# Altium project tnb_mns_power.PrjPcb
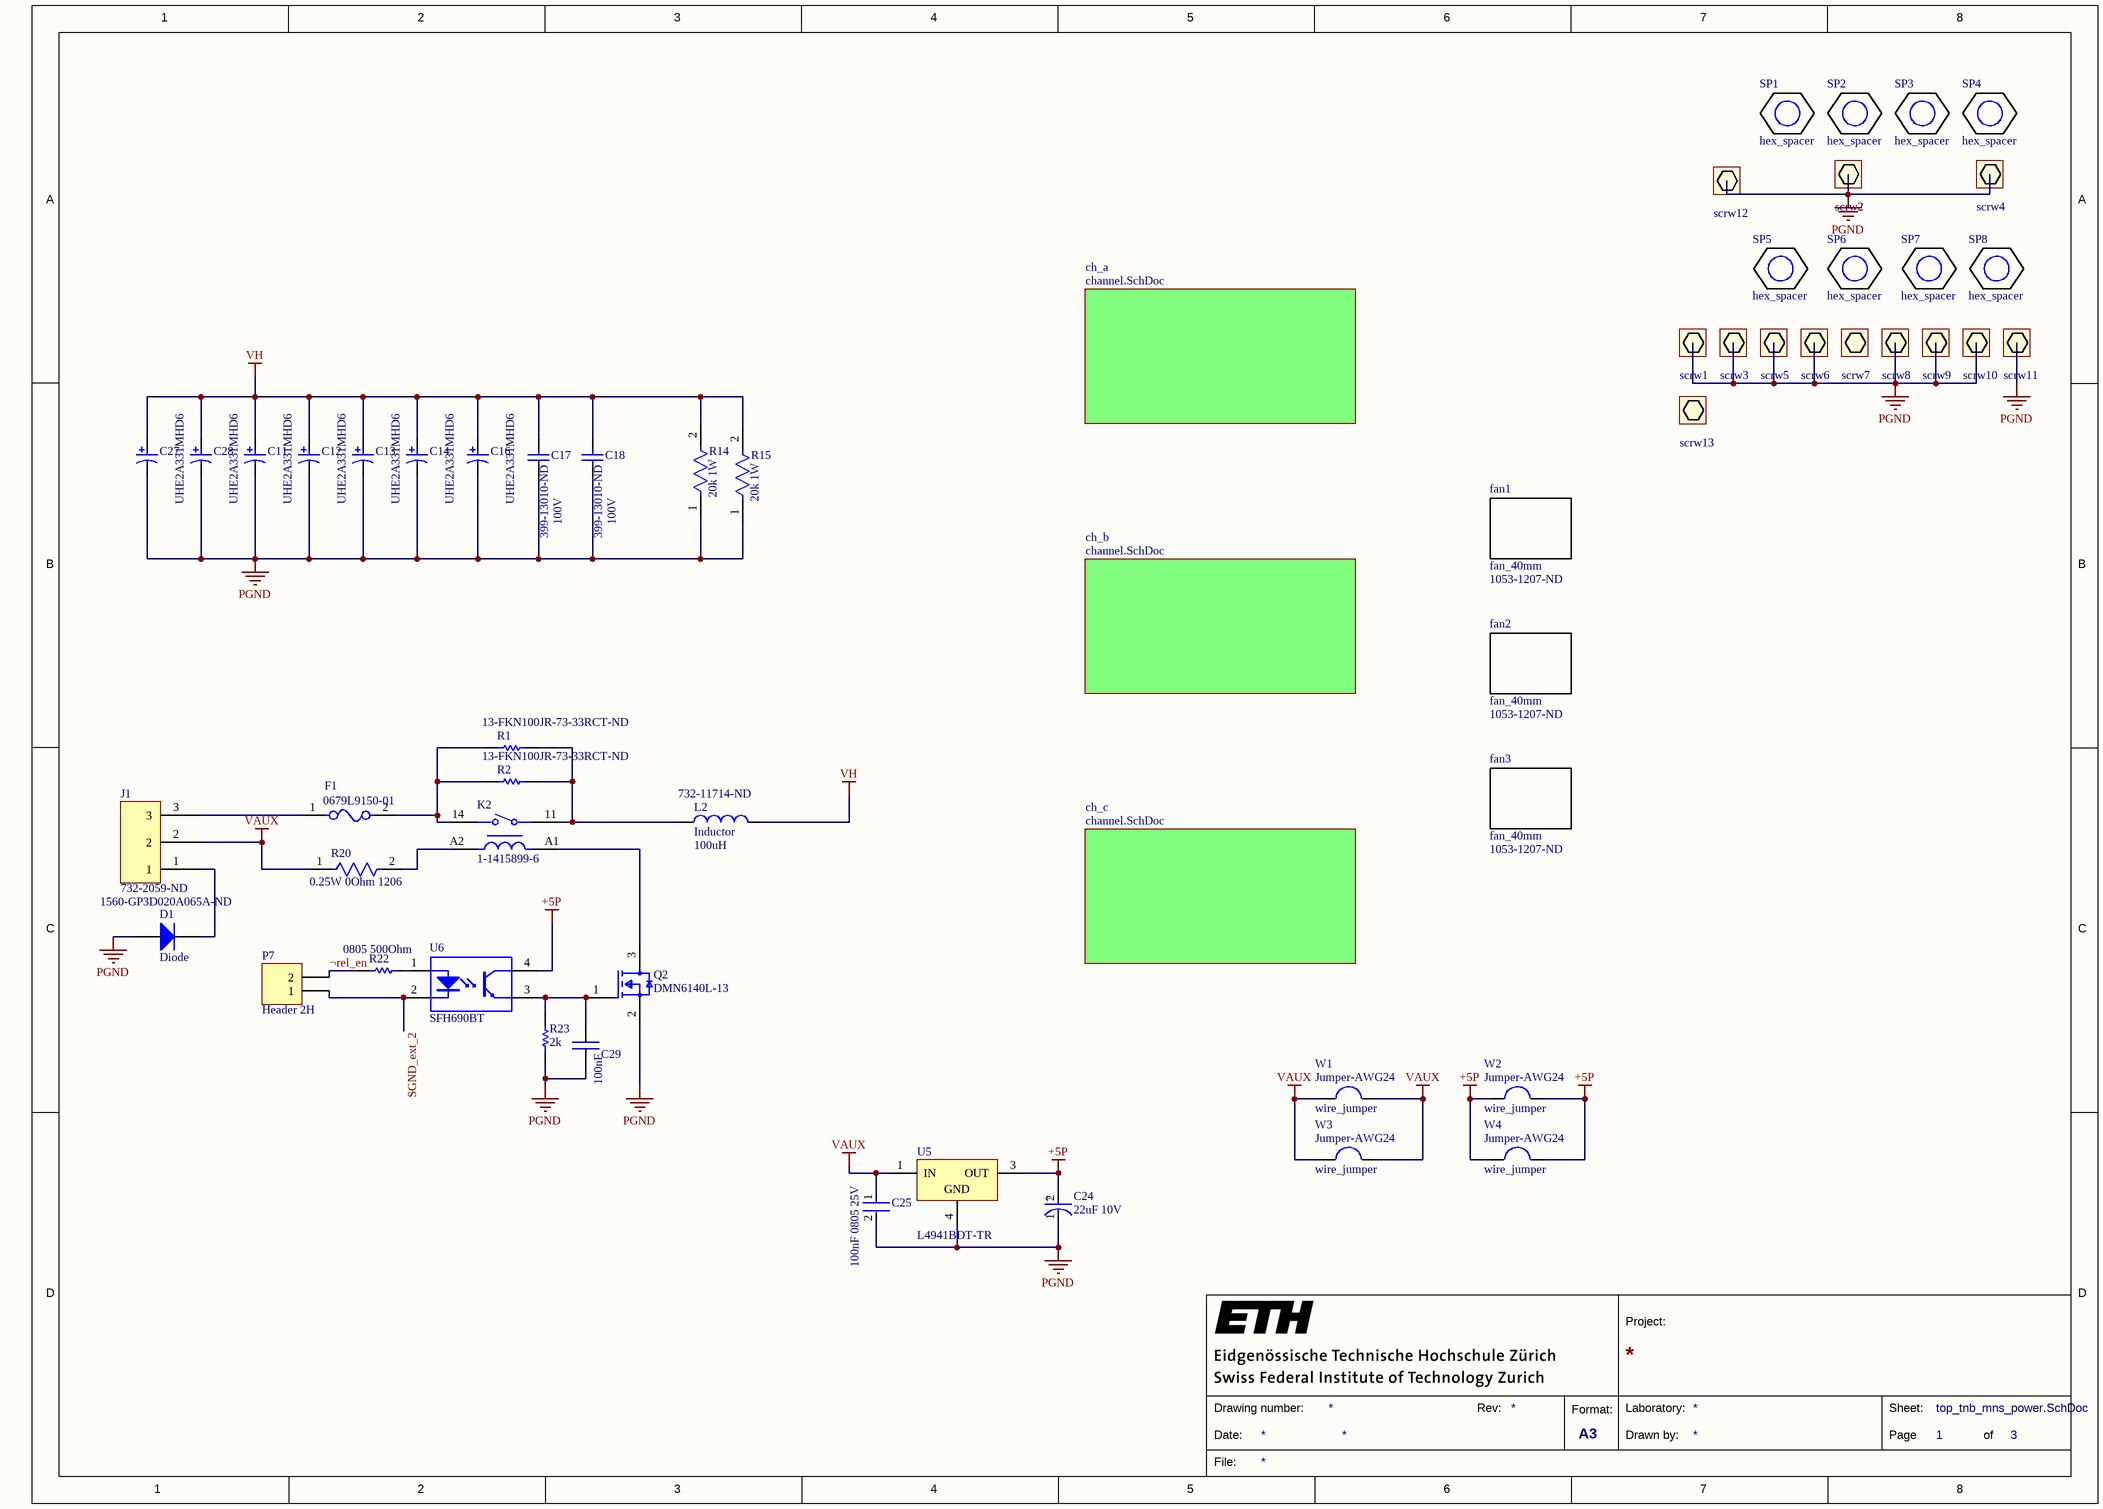
[diagram p0: top_tnb_mns_power.SchDoc]
3 sheets, 344 parts. Net scope: flat (ports and power ports of the same name join across sheets).
Board file: tnb_mns_power.PcbDoc
Sheets:
  top_tnb_mns_power.SchDoc
    ch_a = channel.SchDoc
      drvr_bck = 2EDL23.SchDoc
      aleg = 2EDL23.SchDoc
      bleg = 2EDL23.SchDoc
    ch_b = channel.SchDoc
      drvr_bck = 2EDL23.SchDoc
      aleg = 2EDL23.SchDoc
      bleg = 2EDL23.SchDoc
    ch_c = channel.SchDoc
      drvr_bck = 2EDL23.SchDoc
      aleg = 2EDL23.SchDoc
      bleg = 2EDL23.SchDoc

## Sheet top_tnb_mns_power.SchDoc
size A3; SheetNumber: 1; SheetTotal: 3

### Parts
C11  UHE2A331MHD6  [CAPPR80-750-2000X1800X2200]
C12  UHE2A331MHD6  [CAPPR80-750-2000X1800X2200]
C13  UHE2A331MHD6  [CAPPR80-750-2000X1800X2200]
C14  UHE2A331MHD6  [CAPPR80-750-2000X1800X2200]
C16  UHE2A331MHD6  [CAPPR80-750-2000X1800X2200]
C17  100V  Supplier Part Number 1: 399-13010-ND  [FILM_CAP_100UF_100V_R60EW61005000K]
C18  100V  Supplier Part Number 1: 399-13010-ND  [FILM_CAP_100UF_100V_R60EW61005000K]
C24  22uF 10V  [FP-T491C226K010AT-MFG]
C25  100nF 0805 25V  [FP-CC0805-0_85-MFG]
C27  UHE2A331MHD6  [CAPPR80-750-2000X1800X2200]
C28  UHE2A331MHD6  [CAPPR80-750-2000X1800X2200]
C29  100nF  [CAP 0603_1608]
D1  Diode  Supplier Part Number 1: 1560-GP3D020A065A-ND  [TO-220-2-bent]
F1  0679L9150-01  [FP-0679L-MFG]
fan1  fan_40mm  Supplier Part Number 1: 1053-1207-ND
fan2  fan_40mm  Supplier Part Number 1: 1053-1207-ND
fan3  fan_40mm  Supplier Part Number 1: 1053-1207-ND
J1  Supplier Part Number 1: 732-2059-ND  [691311500103]  (hidden comment: 20A straight)
K2  1-1415899-6  [FP-1-1415899-6-MFG]
L2  Inductor  value 100uH  Supplier Part Number 1: 732-11714-ND  [wurth_inductor_74437529203101_100uH]
P7  Header 2H  [header_2_1_m]
Q2  DMN6140L-13  [FP-SOT23-MFG]
R1  Supplier Part Number 1: 13-FKN100JR-73-33RCT-ND  [safety_resistor_30Ohm_1W]  (hidden comment: 30Ohm Fusable Resistor)
R2  Supplier Part Number 1: 13-FKN100JR-73-33RCT-ND  [safety_resistor_30Ohm_1W]  (hidden comment: 30Ohm Fusable Resistor)
R14  20k 1W  [FP-CRCW2512-e3-IPC_C]
R15  20k 1W  [FP-CRCW2512-e3-IPC_C]
R20  0.25W 0Ohm 1206  [FP-CRCW1206-e3-MFG]
R22  0805 500Ohm  [RES 0805_2012]
R23  2k  [RES 0805_2012]
scrw1  screw_m2_5  [screw_m2_5]  (value not drawn)
scrw2  screw_m2_5  [screw_m2_5]  (value not drawn)
scrw3  screw_m2_5  [screw_m2_5]  (value not drawn)
scrw4  screw_m2_5  [screw_m2_5]  (value not drawn)
scrw5  screw_m2_5  [screw_m2_5]  (value not drawn)
scrw6  screw_m2_5  [screw_m2_5]  (value not drawn)
scrw7  screw_m2_5  [screw_m2_5]  (value not drawn)
scrw8  screw_m2_5  [screw_m2_5]  (value not drawn)
scrw9  screw_m2_5  [screw_m2_5]  (value not drawn)
scrw10  screw_m2_5  [screw_m2_5]  (value not drawn)
scrw11  screw_m2_5  [screw_m2_5]  (value not drawn)
scrw12  screw_m2_5  [screw_m2_5]  (value not drawn)
scrw13  screw_m2_5  [screw_m2_5]  (value not drawn)
SP1  hex_spacer  [HEX_SPACER _8MM_60MM]
SP2  hex_spacer  [HEX_SPACER _8MM_60MM]
SP3  hex_spacer  [HEX_SPACER _8MM_60MM]
SP4  hex_spacer  [HEX_SPACER _8MM_60MM]
SP5  hex_spacer  [HEX_SPACER _8MM_60MM]
SP6  hex_spacer  [HEX_SPACER _8MM_60MM]
SP7  hex_spacer  [HEX_SPACER _8MM_60MM]
SP8  hex_spacer  [HEX_SPACER _8MM_60MM]
U5  L4941BDT-TR  [TO-252_L]
U6  SFH690BT  [VISH-SOP-4_A_V]
W1  wire_jumper  [wire_jumper]
W2  wire_jumper  [wire_jumper]
W3  wire_jumper  [wire_jumper]
W4  wire_jumper  [wire_jumper]

### Sub-sheets
ch_a = channel.SchDoc: no entries
ch_b = channel.SchDoc: no entries
ch_c = channel.SchDoc: no entries

### Nets
+5P: C24.2(A) U5.3(OUT) U6.4(COLLECTOR) W2.1 W2.2 W4.1 W4.2
PGND: C11.2 C12.2 C13.2 C14.2 C16.2 C17.1 C18.1 C24.1(C) C25.2 C27.2 C28.2 C29.2 D1.1(A) Q2.2(S) R14.1 R15.1 R23.1 scrw1.1 scrw2.1 scrw3.1 scrw4.1 scrw5.1 scrw6.1 scrw8.1 scrw9.1 scrw10.1 scrw11.1 scrw12.1 U5.4(GND)
VAUX: C25.1 J1.2 R20.1 U5.1(IN) W1.1 W1.2 W3.1 W3.2
VH: C11.1 C12.1 C13.1 C14.1 C16.1 C17.2 C18.2 C27.1 C28.1 L2.2 R14.2 R15.2
SGND_ext_2: P7.1 U6.2(CATHODE)
¬rel_en: P7.2 R22.1
NetC29_1: C29.1 Q2.1(G) R23.2 U6.3(EMITTER)
NetD1_2: D1.2(K) J1.1
NetF1_1: F1.1 J1.3
NetF1_2: F1.2 K2.14 R1.1 R2.1
NetK2_11: K2.11 L2.1 R1.2 R2.2
NetK2_A1: K2.A1 Q2.3(D)
NetK2_A2: K2.A2 R20.2
NetR22_2: R22.2 U6.1(ANODE)

Not connected (* = marked no-connect by the designer): scrw7 1; scrw13 1

### Notes on the sheet
- 1
- 2
- 3
- 4
- 5
- 6
- 7
- 8
- A
- B
- C
- D
- Project:
- Date:
- Drawing number:
- Rev:
- Format:
- A3
- Drawn by:
- Laboratory:
- Page
- Sheet:
- of
- File:
- (in symbol CMP-03017-000041-1) +
- (in symbol wire_jumper) Jumper-AWG24

### Library data of the parts
C11-C14 C16 C27 C28 = CMP-2000-07350-1: Aluminum Electrolytic Capacitor, 330 uF, +/- 20%, 100 V, -40 to 105 degC, 2-Pin THD, RoHS, Bulk; Manufacturer: Nichicon; Capacitance: 330µF; Rated Voltage: 100V; Type: Radial; Case Size/Dimension: Ø18x20mm; Manufacturer URL: http://www.nichicon.co.jp/english/; Package Description: 2-Pin Through Hole Device, Dia 18 mm, Body Length 22 mm; Package Reference: CAPPR80-750-2000X1800X2200; Mounting Technology: ThroughHole; Datasheet Version: 08/2015; Operating Temp-Max: 105°C; Datasheet URL: http://products.nichicon.co.jp/en/pdf/XJA043/e-uhe.pdf
C17 C18 = Cap: Capacitor; Value: 6800nF; Published: 8-Jun-2000; LatestRevisionDate: 17-Jul-2002; LatestRevisionNote: Re-released for DXP Platform.; PackageReference: RAD-0.3; Publisher: Altium Limited; PackageDescription: Radial Cap, Thru-Hole; 2 Leads; 0.3 in Pin Spacing; Supplier 1: Digi-Key
C24 = CMP-03017-000041-1: CAP TANT 22UF 10% 10V 2312; Polarity: Polar; Leakage Current: 2.2uA; Tolerance: 20%; Life (Hours): 2000Hour; Dissipation Factor: 6%; ESR (Equivalent Series Resistance): 1.8R; Dielectric Material: Tantalum; Packaging: Tape and Reel; Termination: SMD/SMT; Length: 6mm; Voltage Rating (DC): 10V; Series: T491; Case/Package: Molded; Lead Free: Lead Free; Mount: Surface Mount; RoHS Compliant: Yes; Number of Pins: 2; Voltage Rating: 10V; Case Code (Imperial): 2312; Width: 3.2mm; Case Code (Metric): 6032; Voltage: 10V; Depth: 3.2mm; Features: General Purpose; Height - Seated (Max): 0.11inch; Capacitance: 22uF; Size: 2.5mm; Max Operating Temperature: 125°C; Construction: Flat; REACH SVHC: No SVHC; Package Quantity: 1; Min Operating Temperature: -55°C; Radiation Hardening: No; Height: 2.5mm
C25 = CMP-1036-04410-2: CAP CER 0.1UF 25V X7R 0805; Manufacturer Part Number: CC0805KRX7R8BB104; Manufacturer: Yageo; Tolerance: 0.1; Material: Ceramic; ComponentLink2URL: http://www.yageo.com/documents/recent/UPY-GPHC_Y5V_6.3V-to-50V_8.pdf; Category: Cap; Mouser Description: Multilayer Ceramic Capacitors MLCC - SMD/SMT 100nF 25V X7R 10%; Device Class L1: Passive Components; Footprint Url: http://www.yageo.com/exep/pages/download/literatures/UPY-C_GEN_24.pdf; Height: 0.95mm; Digikey Description: CAP CER 0.1UF 25V X7R 0805; Lead Free: Yes; Temperature Range High: +85°C; Temperature: -30°C to +85°C; Ipc Land Pattern Name: CAPC200125X85; Value: 100 nF; Capacitance: 100 nF; Automotive: No; Octopart: https://octopart.com/cc0805krx7r8bb104-yageo-39467766; Device Class L2: Capacitors; Temperature Characteristic: X7R; Voltage Rating: 25 V; ComponentLink2Description: Datasheet; Temperature Range Low: -30°C; Device Class L3: Ceramic Capacitors; RoHS: TRUE; Package: CC0805-0.85
C29 = cap_smd
D1 = Diode: Default Diode; Published: 8-Jun-2000; LatestRevisionDate: 17-Jul-2002; LatestRevisionNote: Re-released for DXP Platform.; PackageVersion: Sep-1996; PackageReference: SMC; Publisher: Altium Limited; PackageDescription: DO-214-AB/SMC; 2 C-Bend Leads; Body 7.9 x 5.9 mm, inc. leads (LxW); Code_JEDEC: DO-214-AB; Supplier 1: Digi-Key
F1 = CMP-16042-000002-1: FUSE BRD MNT 15A 125VAC/VDC; Manufacturer: Bel Fuse; Max Fuse Ac Voltage: 125V; Fuse Blow Speed: Fast; Fuse I2T: 103.5A2Sec; Fuse Interrupt Ac Current: 50A; Automotive Grade: Grade 1; Value: 0.0038Ω; Fuse Interrupt Dc Current: 300A; Fuse Voltage Drop: 0.13V; Device Class L2: Fuses; ComponentLink2URL: https://www.belfuse.com/resources/CircuitProtection/datasheets/0679L%20Sep2016.pdf; Package: 0679L; Height: 2.79mm; Digikey Description: FUSE BRD MNT 15A 125VAC/VDC; Temperature Range High: +125°C; Device Class L3: unset; Octopart: https://octopart.com/0679l9150-01-bel+fuse-70850665; Temperature Range Low: -55°C; Fuse Current: 15A; Max Fuse Dc Voltage: 125V; Ipc Land Pattern Name: CAPC610254X254; Manufacturer Part Number: 0679L9150-01; Category: Fuse; Lead Free: Yes; Automotive: Yes; Resistance: 0.0038Ω; RoHS: TRUE; Device Class L1: Circuit Protection; ComponentLink2Description: Datasheet; Temperature: -55°C to +125°C; Voltage Rating: 125V
J1 = wuerth_connector_straight_30_20A_691311500103: Supplier 1: Digi-Key
K2 = CMP-03395-000032-1: RELAY GEN PURPOSE SPST 16A 12V; Manufacturer: TE Connectivity; Throw Configuration: SPST-NO; Coil Type: Non-Latching; Coil Power: 400mW; Number Of Contacts: 1; Coil Resistance: 360Ω; Height: 16mm; Device Class L1: Electromechanical; ComponentLink2URL: https://www.te.com/commerce/DocumentDelivery/DDEController?Action=showdoc&DocId=Data+Sheet%7FRZ%7F0918%7Fpdf%7FEnglish%7FENG_DS_RZ_0918.pdf%7F1-1415899-6; Current Rating: 16A; RoHS: TRUE; Automotive: No; Lead Free: Yes; Manufacturer Part Number: 1-1415899-6; Digikey Description: RELAY GEN PURPOSE SPST 16A 12V; ComponentLink2Description: Datasheet; Octopart: https://octopart.com/1-1415899-6-te+connectivity-46507462; Package: 1-1415899-6; Coil Voltage: 12V; Device Class L2: Relays; Category: Relay; Ambient Temperature Range Low: -40°C; Device Class L3: Power Relays; Ambient Temperature Range High: +85°C
L2 = Inductor: Code_IEC: 1005; Published: 8-Jun-2000; LatestRevisionDate: 29-May-2009; LatestRevisionNote: IPC-7351 Footprint Added.; PackageReference: 0402-A; Publisher: Altium Limited; PackageDescription: Chip Inductor; Code_JEITA: 0402; Supplier 1: Digi-Key
P7 = Header 2H: Header, 2-Pin, Right Angle; LatestRevisionDate: 17-Jul-2002; LatestRevisionNote: Re-released for DXP Platform.; Publisher: Altium Limited
Q2 = CMP-12801-000047-1: MOSFET N-CH 60V 1.6A SOT23; Manufacturer: Diodes Inc.; Turn Off Delay Time: 16.3ns; Power Dissipation: 0.7W; Pulse Drain Current: 10A; Number Of Channels: 1; Reverse Recovery Time: 16.8ns; Typ Forward Diode Voltage: 0.75V; Gate To Source Voltage: 20V; Rthja Max: 183°C/W; Gate Charge At Vgs: 8.6nC @ 10V; Drain To Source Resistance: 92mΩ; Depletion Mode: False; Max Junction Temp: +150°C; Max Forward Diode Voltage: 1V; Reverse Recovery Charge: 9nC; Input Capacitace At Vds: 315pF @ 40V; Standoff Height: 0.013mm; Threshold Vgs Max: 3V; Turn On Delay Time: 2.6ns; Mouser Description: MOSFET 31V to 99V N-Ch FET 60Vds 20Vgs 2.3A; ComponentLink2Description: Datasheet; Digikey Description: MOSFET N-CH 60V 1.6A SOT23; Lead Free: Yes; Category: Trans; Device Class L3: MOSFETs; Temperature Range High: +150°C; Octopart: https://octopart.com/dmn6140l-13-diodes+inc.-38898616; Drain To Source Voltage: 60V; ComponentLink2URL: https://www.diodes.com/assets/Datasheets/DMN6140L.pdf; Drain To Source Breakdown Voltage: 60V; Footprint Url: https://www.diodes.com/assets/Package-Files/SOT23.pdf; Package: SOT23; Continuous Drain Current: 1.6A; Device Class L1: Discrete Semiconductors; Device Class L2: Transistors; Number Of N Channels: 1; Temperature Range Low: -55°C; Height: 1.1mm; Manufacturer Part Number: DMN6140L-13; RoHS: TRUE; Temperature: -55°C to +150°C; Threshold Vgs Min: 1V; Automotive: No
R1 R2 = Res1: Resistor; Value: 30; Published: 8-Jun-2000; LatestRevisionDate: 17-Jul-2002; LatestRevisionNote: Re-released for DXP Platform.; PackageReference: AXIAL-0.3; Publisher: Altium Limited; PackageDescription: Axial Device, Thru-Hole; 2 Leads; 0.3 in Pin Spacing; Supplier 1: Digi-Key
R14 R15 = CMP-02407-007498-1: RES Thick Film, 20kΩ, 1%, 1W, 100ppm/°C, 2512 / CRCW251220K0FKEG; Resistance: 20kR; Voltage Rating (DC): 500V; Height: 0.028inch; Contact Plating: Tin; Termination: SMD/SMT; Tolerance: 1%; Package Quantity: 10; Temperature Coefficient: 100ppm/°C; Depth: 3.15mm; Number of Terminations: 2; Features: Automotive AEC-Q200; Max Power Dissipation: 1W; Length: 6.3mm; Case Code (Imperial): 2512; Military Standard: Not; Packaging: Tape and Reel; Case Code (Metric): 6432; Power Rating: 1W; Max Operating Temperature: 155°C; Weight: 0.001429oz; Composition: Thick Film; Min Operating Temperature: -55°C; Width: 0.124inch; Number of Pins: 2; Voltage Rating: 500V; Radiation Hardening: No; Lead Free: Lead Free; Case/Package: 2512
R20 = CMP-2003-04801-2: RES Thick Film, 100Ω, 1%, 0.25W, 100ppm/°C, 1206 / CRCW1206100RFKEA; Voltage Rating (DC): 200V; Resistance: 100R; Power Rating: 250mW; Case Code (Metric): 3216; Radiation Hardening: No; Height: 0.55mm; Packaging: Tape and Reel; Depth: 1.6mm; Weight: 0.000353oz; Termination: SMD/SMT; Lead Free: Lead Free; Min Operating Temperature: -55°C; Contact Plating: Tin; Max Operating Temperature: 155°C; Case Code (Imperial): 1206; Military Standard: Not; Width: 1.6mm; Number of Pins: 2; Voltage Rating: 200V; Composition: Thick Film; Package Quantity: 5000; Tolerance: 1%; Case/Package: 1206; Mount: Surface Mount; Length: 3.2mm; Temperature Coefficient: 100ppm/°C
R22 R23 = Res1: Resistor; Value: 1K; Published: 8-Jun-2000; LatestRevisionDate: 17-Jul-2002; LatestRevisionNote: Re-released for DXP Platform.; PackageReference: AXIAL-0.3; Publisher: Altium Limited; PackageDescription: Axial Device, Thru-Hole; 2 Leads; 0.3 in Pin Spacing
U5 = CMP-0244-00200-1: 1A Very Low Drop Regulator, 3-Pin DPAK, Tape and Reel; PackageDescription: 3-Pin Transistor Outline Package 2.28 mm Pitch, 9.7 mm Lead Span (DPAK); ComponentLink2URL: http://www.st.com/internet/com/TECHNICAL_RESOURCES/TECHNICAL_LITERATURE/DATASHEET/CD00000443.pdf; ComponentLink1URL: http://www.st.com; DatasheetVersion: 15/09/2006; PackageReference: TO-252; PackageVersion: 2011; ComponentLink2Description: Datasheet; ComponentLink1Description: Manufacturer URL
U6 = CMP-2000-07046-1: Optocoupler Phototransistor Output, 6 V, 50 mA, -55 to 100 degC, 4-Pin SOIC, RoHS, Tape and Reel; Manufacturer: Vishay; Collector Current (DC): 0.1A; Input Type: DC; Collector-Emitter Voltage: 70V; Forward Current: 50mA; Isolation Voltage: 3750V; DELETED: Compliant; Collector-Emitter Saturation Voltage: 0.3V; Power Dissipation: 0.15W; Reverse Breakdown Voltage: 6V; Number of  Elements: 1; Forward Voltage: 1.4V; Rad Hardened: No; Current Transfer Ratio: 300%; Datasheet Version: Rev. 2.6, 11/2015; Manufacturer URL: http://www.vishay.com/; Output Type: DC; Package Reference: SOP-4; Operating Temperature Classification: Industrial; Mounting Technology: SurfaceMount; Mounting: SurfaceMount; Output Device: Transistor; Package Description: 4-Pin Small Outline Package Integrated Circuit, Body 4.575 x 4.42 mm, Pitch 2.54 mm; Package Type: SOP; Operating Temp Range: -55Cto100C; Packaging: TapeandReel; Collector Current (DC) (Max): 0.1A; Pin Count: 4; Datasheet URL: http://www.vishay.com/docs/83686/sfh690ab.pdf
fan1-fan3 = fan_40mm: Supplier 1: Digi-Key

## Sheet channel.SchDoc
size A3; SheetNumber: 2; SheetTotal: 3
Used 3 times, as channels ch_a, ch_b, ch_c. Parts and nets are listed once, with the designators drawn on the sheet.
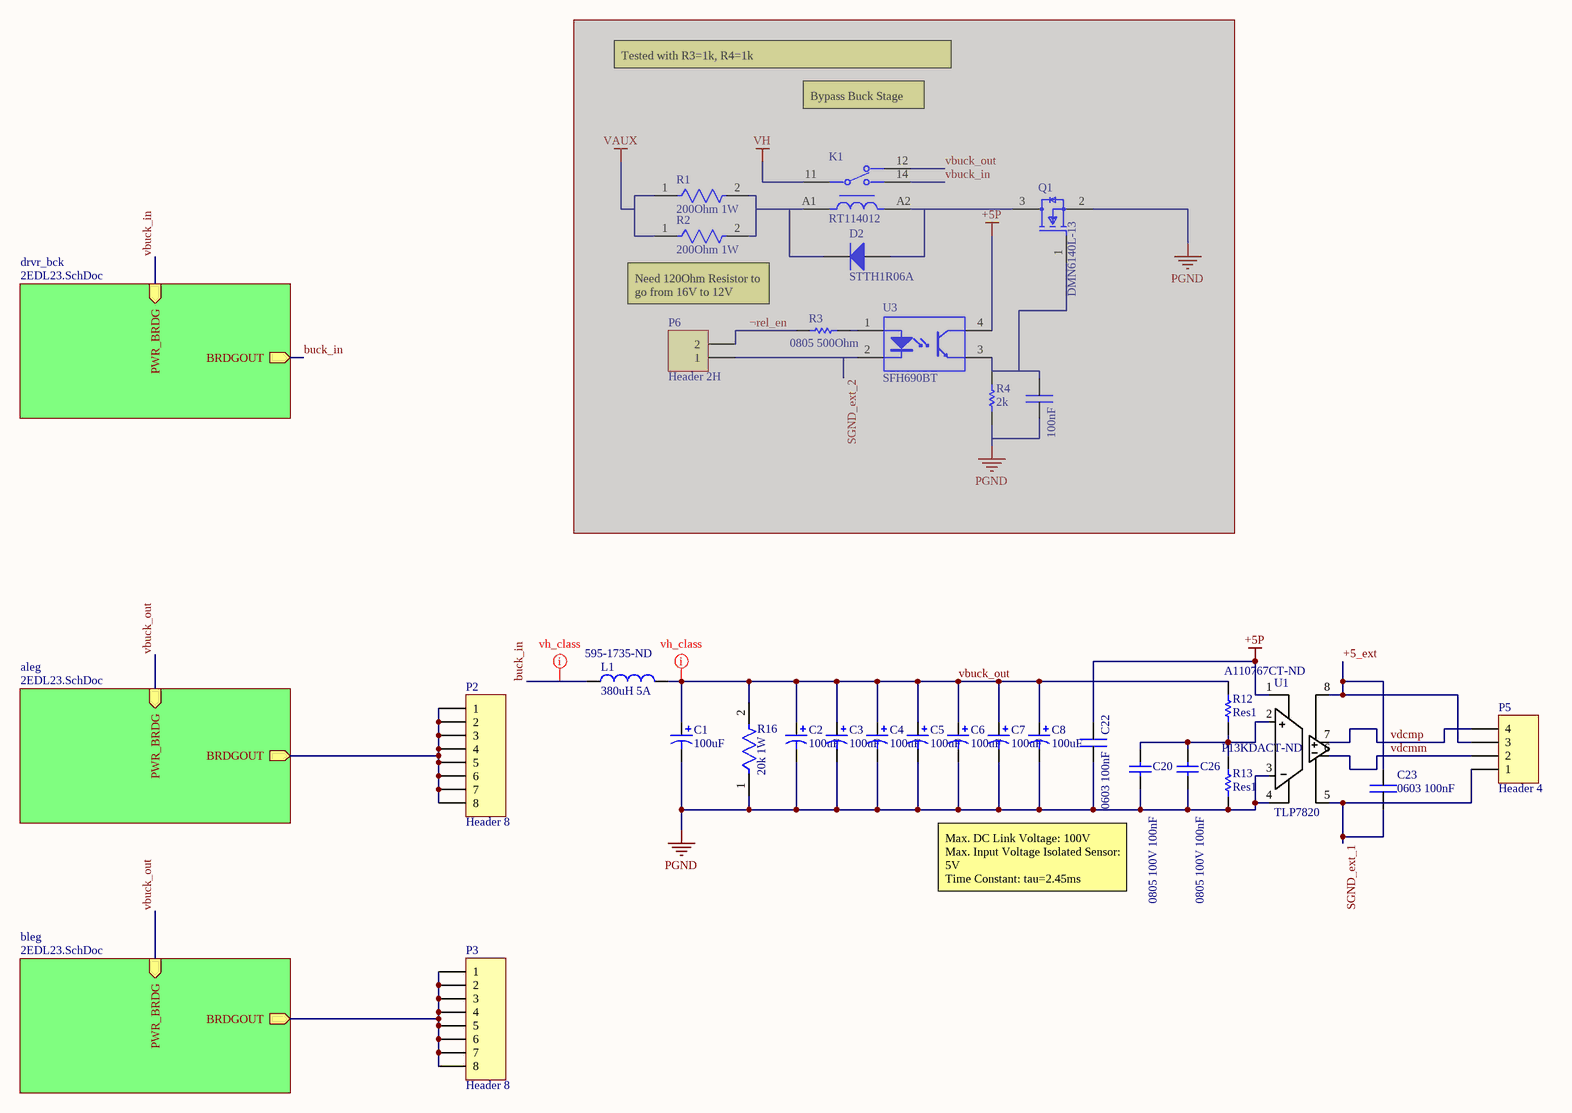
[diagram p1: channel.SchDoc]

### Parts
C1  100uF  [electrolyte_10mm_5mm]
C2  100uF  [electrolyte_10mm_5mm]
C3  100uF  [electrolyte_10mm_5mm]
C4  100uF  [electrolyte_10mm_5mm]
C5  100uF  [electrolyte_10mm_5mm]
C6  100uF  [electrolyte_10mm_5mm]
C7  100uF  [electrolyte_10mm_5mm]
C8  100uF  [electrolyte_10mm_5mm]
C19  100nF  [CAP 0603_1608]  (masked out: inside a compile mask, not in the netlist)
C20  0805 100V 100nF  [CAP 0805_2012]
C22  0603 100nF  [CAP 0603_1608]
C23  0603 100nF  [CAP 0603_1608]
C26  0805 100V 100nF  [CAP 0805_2012]
D2  STTH1R06A  [STM-STTH1R06A-SMA-2_V]  (masked out: inside a compile mask, not in the netlist)
K1  RT114012  [FP-RT114012-MFG]  (masked out: inside a compile mask, not in the netlist)
L1  380uH 5A  Supplier Part Number 1: 595-1735-ND  [inductor_HCTI-390-5.0]
P2  Header 8  [HEADER_4_2]
P3  Header 8  [HEADER_4_2]
P5  Header 4  [header_2_2_m]
P6  Header 2H  [header_2_1_m]  (masked out: inside a compile mask, not in the netlist)
Q1  DMN6140L-13  [FP-SOT23-MFG]  (masked out: inside a compile mask, not in the netlist)
R1  200Ohm 1W  [FP-CRCW2512-e3-MFG]  (masked out: inside a compile mask, not in the netlist)
R2  200Ohm 1W  [FP-CRCW2512-e3-MFG]  (masked out: inside a compile mask, not in the netlist)
R3  0805 500Ohm  [RES 0805_2012]  (masked out: inside a compile mask, not in the netlist)
R4  2k  [RES 0805_2012]  (masked out: inside a compile mask, not in the netlist)
R12  Res1  Supplier Part Number 1: A110767CT-ND  [RES 1206_3216]
R13  Res1  Supplier Part Number 1: P13KDACT-ND  [RES 1206_3216]
R16  20k 1W  [FP-CRCW2512-e3-IPC_C]
U1  TLP7820  [TLP7820]
U3  SFH690BT  [VISH-SOP-4_A_V]  (masked out: inside a compile mask, not in the netlist)

### Sub-sheets
aleg = 2EDL23.SchDoc: PWR_BRDG (in), BRDGOUT (out)
bleg = 2EDL23.SchDoc: PWR_BRDG (in), BRDGOUT (out)
drvr_bck = 2EDL23.SchDoc: PWR_BRDG (in), BRDGOUT (out)

### Nets
+5P: C22.1 U1.1
PGND: C1.2 C2.2 C3.2 C4.2 C5.2 C6.2 C7.2 C8.2 C20.1 C22.2 C26.1 R13.1 R16.1 U1.3 U1.4
+5_ext: C23.2 P5.3 U1.8
buck_in: L1.1 ; sheet drvr_bck/BRDGOUT
SGND_ext_1: C23.1 P5.1 U1.5
vbuck_in: sheet drvr_bck/PWR_BRDG
vbuck_out: C1.1 C2.1 C3.1 C4.1 C5.1 C6.1 C7.1 C8.1 L1.2 R12.2 R16.2 ; sheet aleg/PWR_BRDG, sheet bleg/PWR_BRDG
vdcmm: P5.2 U1.6
vdcmp: P5.4 U1.7
NetC20_2: C20.2 C26.2 R12.1 R13.2 U1.2
NetP2_1: P2.1 P2.2 P2.3 P2.4 P2.5 P2.6 P2.7 P2.8 ; sheet aleg/BRDGOUT
NetP3_1: P3.1 P3.2 P3.3 P3.4 P3.5 P3.6 P3.7 P3.8 ; sheet bleg/BRDGOUT

### Channels
ch_a: designators end in _ch_a
ch_b: designators end in _ch_b
ch_c: designators end in _ch_c

### Layout directives
net class VH: buck_in_ch_a, vbuck_out_ch_a

### Notes on the sheet
- Tested with R3=1k, R4=1k
  Logic Pin Current should be around 3mA to 2mA.
- Bypass Buck Stage
- Need 120Ohm Resistor to go from 16V to 12V
- Max. DC Link Voltage: 100V
  Max. Input Voltage Isolated Sensor: 5V
  Time Constant: tau=2.45ms
- 1
- 2
- 3
- 4
- 5
- 6
- 7
- 8
- A
- B
- C
- D
- Project:
- Date:
- Drawing number:
- Rev:
- Format:
- A3
- Drawn by:
- Laboratory:
- Page
- Sheet:
- of
- File:

### Library data of the parts
C1-C8 = Cap Pol1: Polarized Capacitor (Radial); Published: 8-Jun-2000; LatestRevisionDate: 17-Jul-2002; LatestRevisionNote: Re-released for DXP Platform.; PackageReference: RB7.6-15; Publisher: Altium Limited; PackageDescription: Polarized Capacitor (Radial); 2 Leads; Supplier 1: Digi-Key; Supplier Part Number 1: P124237-ND
C19 C22 C23 = cap_smd
  C22 C23: Supplier 1: Digi-Key; Supplier Part Number 1: 445-5666-1-ND
C20 C26 = Cap: Capacitor; Value: 100pF; Published: 8-Jun-2000; LatestRevisionDate: 17-Jul-2002; LatestRevisionNote: Re-released for DXP Platform.; PackageReference: RAD-0.3; Publisher: Altium Limited; PackageDescription: Radial Cap, Thru-Hole; 2 Leads; 0.3 in Pin Spacing; Supplier 1: Digi-Key; Supplier Part Number 1: 478-5028-1-ND
D2 = CMP-0738-00001-1: Turbo 2 Ultrafast High Voltage Rectifier, 600 V, 1 A, 2-Pin SMA Package, Pb-Free, RoHS, Tape and Reel; Manufacturer: STMicroelectronics; Trr (max): 25 ns; VF (typ): 1 V; Tj: 175 degC; IR (max): 75 uA; IF (AV): 1 A; IF (RMS): 7 A; VRRM: 600 V; RoHS: TRUE; ComponentLink2Description: Datasheet; Packing: Tape and Reel; ComponentLink1URL: http://www.st.com/; ComponentLink3Description: Package Specification; ComponentLink1Description: Manufacturer URL; PackageDescription: 2-Pin SMD, Body 4.275 x 2.575 mm, Height 2.65 mm; PackageVersion: Rev. 5; ComponentLink2URL: http://www.st.com/st-web-ui/static/active/en/resource/technical/document/datasheet/CD00005135.pdf; Mounting Technology: Surface Mount; PartNumber: STTH1R06A; DatasheetVersion: Rev. 5; ComponentLink3URL: http://www.st.com/st-web-ui/static/active/en/resource/technical/document/datasheet/CD00005135.pdf; PackageReference: STTH1R06A-SMA-2
K1 = CMP-03395-000068-1: RELAY GEN PURPOSE SPDT 12A 12V; Manufacturer: TE Connectivity; Coil Power: 400mW; Coil Resistance: 360Ω; Coil Type: Non-Latching; Number Of Contacts: 1; Height: 15.7mm; Throw Configuration: SPDT; Mouser Description: General Purpose Relays RT114012; Device Class L1: Electromechanical; ComponentLink2URL: https://www.te.com/commerce/DocumentDelivery/DDEController?Action=showdoc&DocId=Data+Sheet%7FRT1%7F0219%7Fpdf%7FEnglish%7FENG_DS_RT1_0219.pdf%7F1419108-1; Digikey Description: RELAY GEN PURPOSE SPDT 12A 12V; Package: RT114012; RoHS: TRUE; ComponentLink2Description: Datasheet; Octopart: https://octopart.com/rt114012-te+connectivity-39636422; Device Class L2: Relays; Manufacturer Part Number: RT114012; Ambient Temperature Range High: +85°C; Ambient Temperature Range Low: -40°C; Coil Voltage: 12V; Current Rating: 12A; Category: Relay; Lead Free: Yes; Device Class L3: Power Relays; Automotive: No
L1 = Inductor: Code_IEC: 1005; Value: 390uH; Published: 8-Jun-2000; LatestRevisionDate: 29-May-2009; LatestRevisionNote: IPC-7351 Footprint Added.; PackageReference: 0402-A; Publisher: Altium Limited; PackageDescription: Chip Inductor; Code_JEITA: 0402; Supplier 1: Digi-Key
P2 P3 = Header 8: Header, 8-Pin; LatestRevisionDate: 17-Jul-2002; LatestRevisionNote: Re-released for DXP Platform.; Publisher: Altium Limited
P5 = Header 4: Header, 4-Pin; LatestRevisionDate: 17-Jul-2002; LatestRevisionNote: Re-released for DXP Platform.; Publisher: Altium Limited
P6 = Header 2H: Header, 2-Pin, Right Angle; LatestRevisionDate: 17-Jul-2002; LatestRevisionNote: Re-released for DXP Platform.; Publisher: Altium Limited
Q1 = CMP-12801-000047-1: as Q2 on sheet top_tnb_mns_power; Mouser Description: MOSFET 31V to 99V N-Ch FET 60Vds 20Vgs 2.3A; ComponentLink2Description: Datasheet; Digikey Description: MOSFET N-CH 60V 1.6A SOT23; Lead Free: Yes; Category: Trans; Device Class L3: MOSFETs; Temperature Range High: +150°C; Octopart: https://octopart.com/dmn6140l-13-diodes+inc.-38898616; Drain To Source Voltage: 60V; ComponentLink2URL: https://www.diodes.com/assets/Datasheets/DMN6140L.pdf; Drain To Source Breakdown Voltage: 60V; Footprint Url: https://www.diodes.com/assets/Package-Files/SOT23.pdf; Package: SOT23; Continuous Drain Current: 1.6A; Device Class L1: Discrete Semiconductors; Device Class L2: Transistors; Number Of N Channels: 1; Temperature Range Low: -55°C; Height: 1.1mm; Manufacturer Part Number: DMN6140L-13; RoHS: TRUE; Temperature: -55°C to +150°C; Threshold Vgs Min: 1V; Automotive: No
R1 R2 = CMP-02407-003477-1: RES Thick Film, 200Ω, 1%, 1W, 100ppm/°C, 2512; Voltage Rating (DC): 500V; Resistance: 200R; Width: 3.15mm; Tolerance: 1%; Length: 6.3mm; Contact Plating: Tin; Case Code (Metric): 6432; Military Standard: Not; Package Quantity: 10; Composition: Thick Film; Packaging: Tape and Reel; Lead Free: Lead Free; Features: Automotive AEC-Q200; Max Operating Temperature: 155°C; Max Power Dissipation: 1W; Case/Package: 2512; Case Code (Imperial): 2512; Termination: SMD/SMT; Min Operating Temperature: -55°C; Power Rating: 1W; Weight: 0.001429oz; Radiation Hardening: No; Height: 0.028inch; Voltage Rating: 500V; Number of Pins: 2; Depth: 3.15mm; Number of Terminations: 2; Temperature Coefficient: 100ppm/°C
R3 R4 R12 R13 = Res1: Resistor; Value: 1K; Published: 8-Jun-2000; LatestRevisionDate: 17-Jul-2002; LatestRevisionNote: Re-released for DXP Platform.; PackageReference: AXIAL-0.3; Publisher: Altium Limited; PackageDescription: Axial Device, Thru-Hole; 2 Leads; 0.3 in Pin Spacing
  R12 R13: Supplier 1: Digi-Key
R16 = CMP-02407-007498-1: as R14 on sheet top_tnb_mns_power; Height: 0.028inch; Contact Plating: Tin; Termination: SMD/SMT; Tolerance: 1%; Package Quantity: 10; Temperature Coefficient: 100ppm/°C; Depth: 3.15mm; Number of Terminations: 2; Features: Automotive AEC-Q200; Max Power Dissipation: 1W; Length: 6.3mm; Case Code (Imperial): 2512; Military Standard: Not; Packaging: Tape and Reel; Case Code (Metric): 6432; Power Rating: 1W; Max Operating Temperature: 155°C; Weight: 0.001429oz; Composition: Thick Film; Min Operating Temperature: -55°C; Width: 0.124inch; Number of Pins: 2; Voltage Rating: 500V; Radiation Hardening: No; Lead Free: Lead Free; Case/Package: 2512
U3 = CMP-2000-07046-1: as U6 on sheet top_tnb_mns_power; Datasheet Version: Rev. 2.6, 11/2015; Manufacturer URL: http://www.vishay.com/; Output Type: DC; Package Reference: SOP-4; Operating Temperature Classification: Industrial; Mounting Technology: SurfaceMount; Mounting: SurfaceMount; Output Device: Transistor; Package Description: 4-Pin Small Outline Package Integrated Circuit, Body 4.575 x 4.42 mm, Pitch 2.54 mm; Package Type: SOP; Operating Temp Range: -55Cto100C; Packaging: TapeandReel; Collector Current (DC) (Max): 0.1A; Pin Count: 4; Datasheet URL: http://www.vishay.com/docs/83686/sfh690ab.pdf
U1 = TLP7820: Supplier 1: Digi-Key; Supplier Part Number 1: TLP7820(TLECT-ND

## Sheet 2EDL23.SchDoc
size A3; SheetNumber: 3; SheetTotal: 3
Used 9 times, as channels ch_a/drvr_bck, ch_a/aleg, ch_a/bleg, ch_b/drvr_bck, ch_b/aleg, ch_b/bleg, ch_c/drvr_bck, ch_c/aleg, ch_c/bleg. Parts and nets are listed once, with the designators drawn on the sheet.
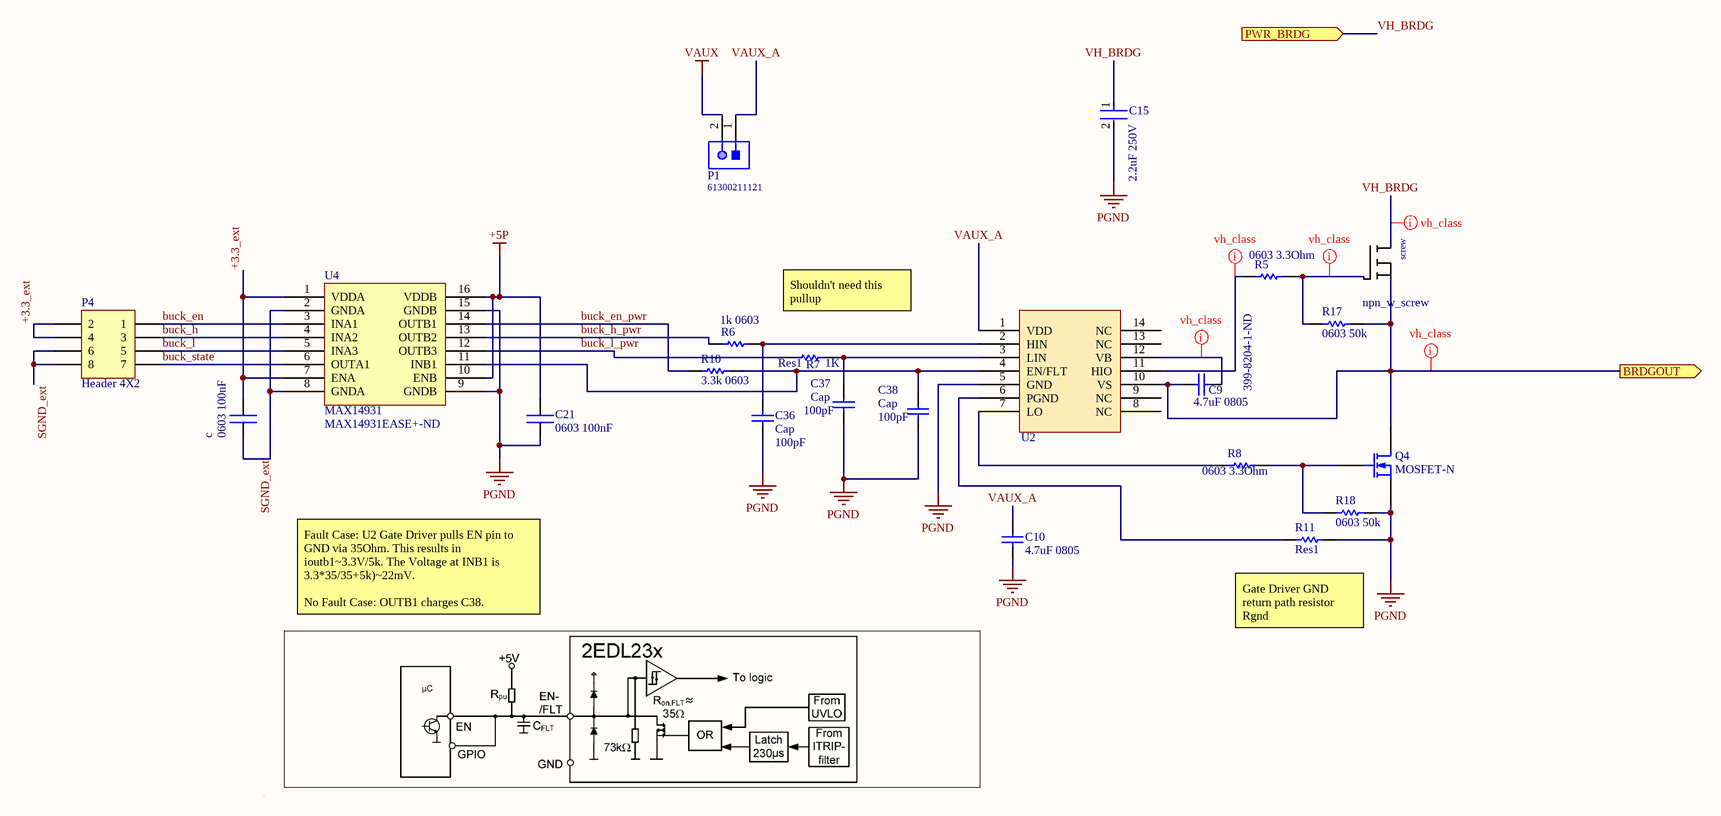
[diagram p2: 2EDL23.SchDoc]

### Parts
c  0603 100nF  [CAP 0603_1608]
C9  4.7uF 0805  Supplier Part Number 1: 399-8204-1-ND  [CAP 1206_3216 - 0.8MM]
C10  4.7uF 0805  [CAP 0805_2012]
C15  2.2uF 250V  [FP-CGA9P-IPC_B]
C21  0603 100nF  [CAP 0603_1608]
C36  Cap  value 100pF  [CAP 0603_1608]
C37  Cap  value 100pF  [CAP 0603_1608]
C38  Cap  value 100pF  [CAP 0603_1608]
P1  61300211121  [61300211121]
P4  Header 4X2  [HEADER_4_2]
Q3  npn_w_screw  [TO-220_3_bent]
Q4  MOSFET-N  [TO-220_3_bent]
R5  0603 3.3Ohm  [RES 1206_3216]
R6  1k 0603  [RES 0603_1608]
R7  Res1  value 1K  [RES 0603_1608]
R8  0603 3.3Ohm  [RES 1206_3216]
R10  3.3k 0603  [RES 0603_1608]
R11  Res1  [RES 0805_2012]
R17  0603 50k  [RES 0603_1608]
R18  0603 50k  [RES 0603_1608]
U2  -  [2EDL23I06PJ]  (value not drawn)
U4  MAX14931  Supplier Part Number 1: MAX14931EASE+-ND  [SOP16_narrow]

### Ports
BRDGOUT (out), PWR_BRDG (in)

### Nets
+5P: C21.1 U4.10(ENB) U4.16(VDDB)
PGND: C10.1 C15.2 C21.2 C36.1 C37.1 C38.1 Q4.3(S) R11.2 R18.2 U2.5(GND) U4.9(GNDB) U4.15(GNDB)
VAUX: P1.2
+3.3_ext: c.1 P4.2 P4.4 U4.1(VDDA) U4.7(ENA)
BRDGOUT: C9.1 Q3.3 Q4.1(D) R17.2 U2.10(VS) ; port BRDGOUT
buck_en: P4.1 U4.3(INA1)
buck_en_pwr: R10.2 U4.14(OUTB1)
buck_h: P4.3 U4.4(INA2)
buck_h_pwr: R6.1 U4.13(OUTB2)
buck_l: P4.5 U4.5(INA3)
buck_l_pwr: R7.1 U4.12(OUTB3)
buck_state: P4.7 U4.6(OUTA1)
SGND_ext: c.2 P4.6 P4.8 U4.2(GNDA) U4.8(GNDA)
VAUX_A: C10.2 P1.1 U2.1(VDD)
VH_BRDG: C15.1 Q3.1 ; port PWR_BRDG
NetC9_2: C9.2 U2.12(VB)
NetC36_2: C36.2 R6.2 U2.2(HIN)
NetC37_2: C37.2 R7.2 U2.3(LIN)
NetC38_2: C38.2 R10.1 U2.4(EN/FLT) U4.11(INB1)
NetQ3_2: Q3.2 R5.2 R17.1
NetQ4_2: Q4.2(G) R8.2 R18.1
NetR5_1: R5.1 U2.11(HIO)
NetR8_1: R8.1 U2.7(LO)
NetR11_1: R11.1 U2.6(PGND)

Not connected (* = marked no-connect by the designer): Q3 4(screw); U2 8(NC) 9(NC) 13(NC) 14(NC)

### Channels
ch_a/drvr_bck: designators end in _ch_a_drvr_bck; ports BRDGOUT=NetC9_ch_a_aleg_1 PWR_BRDG=VH_BRDG
ch_a/aleg: designators end in _ch_a_aleg; ports BRDGOUT=NetC9_ch_a_aleg_1 PWR_BRDG=VH_BRDG
ch_a/bleg: designators end in _ch_a_bleg; ports BRDGOUT=NetC9_ch_a_aleg_1 PWR_BRDG=VH_BRDG
ch_b/drvr_bck: designators end in _ch_b_drvr_bck; ports BRDGOUT=NetC9_ch_a_aleg_1 PWR_BRDG=VH_BRDG
ch_b/aleg: designators end in _ch_b_aleg; ports BRDGOUT=NetC9_ch_a_aleg_1 PWR_BRDG=VH_BRDG
ch_b/bleg: designators end in _ch_b_bleg; ports BRDGOUT=NetC9_ch_a_aleg_1 PWR_BRDG=VH_BRDG
ch_c/drvr_bck: designators end in _ch_c_drvr_bck; ports BRDGOUT=NetC9_ch_a_aleg_1 PWR_BRDG=VH_BRDG
ch_c/aleg: designators end in _ch_c_aleg; ports BRDGOUT=NetC9_ch_a_aleg_1 PWR_BRDG=VH_BRDG
ch_c/bleg: designators end in _ch_c_bleg; ports BRDGOUT=NetC9_ch_a_aleg_1 PWR_BRDG=VH_BRDG

### Layout directives
net class VH: NetC9_ch_a_aleg_1, NetC9_ch_a_drvr_bck_2, NetQ3_ch_a_drvr_bck_2, NetR5_ch_a_drvr_bck_1, VH_BRDG

### Notes on the sheet
- Shouldn't need this pullup
- Fault Case: U2 Gate Driver pulls EN pin to GND via 35Ohm. This results in ioutb1~3.3V/5k. The Voltage at INB1 is 3.3*35/35+5k)~22mV.
  No Fault Case: OUTB1 charges C38.
- (near R11) Gate Driver GND return path resistor Rgnd
- 1
- 2
- 3
- 4
- 5
- 6
- 7
- 8
- A
- B
- C
- D
- Project:
- Date:
- Drawing number:
- Rev:
- Format:
- A3
- Drawn by:
- Laboratory:
- Page
- Sheet:
- of
- File:

### Library data of the parts
c C21 = cap_smd: Supplier 1: Digi-Key; Supplier Part Number 1: 445-5666-1-ND
C9 C10 C36-C38 = Cap: Capacitor; Published: 8-Jun-2000; LatestRevisionDate: 17-Jul-2002; LatestRevisionNote: Re-released for DXP Platform.; PackageReference: RAD-0.3; Publisher: Altium Limited; PackageDescription: Radial Cap, Thru-Hole; 2 Leads; 0.3 in Pin Spacing
  C9: Supplier 1: Digi-Key
C15 = CMP-08246-001668-1: Cap Ceramic 2.2uF 250V X7T 20% Pad SMD 2220 +125°C Automotive T/R / CGA9P3X7T2E225M250KE; Weight: 0.016932oz; Width: 0.197inch; Depth: 5mm; Termination: SMD/SMT; Capacitance: 2.2uF; Voltage Rating (DC): 250V; Dielectric: X7T; Case/Package: 2220; Package Quantity: 500; Height: 2.5mm; Min Operating Temperature: -55°C; Case Code (Metric): 5750; Features: Soft Termination; Max Operating Temperature: 125°C; Ratings: AEC-Q200; Thickness: 0.098inch; Length: 5.7mm; Mount: Surface Mount; Tolerance: 20%; Voltage Rating: 250V; Case Code (Imperial): 2220; Packaging: Tape and Reel
P1 = CMP-1712-00002-4: THT Vertical Pin Header WR-PHD, Pitch 2.54 mm, Single Row, 2 pins; Manufacturer: Wurth Elektronik; Rated Current: 3A; Gender: Male; Withstanding Voltage: 500VAC; Working Voltage: 250VAC; Pitch: 2.54mm; Contact Resistance: 20mOhm; Pin Number: 2; Mounting Technology: THT; Orientation: Vertical; Operating Temperature: -40to105degC; Packaging: Bag; Publisher: WurthElektronik; Datasheet URL: https://katalog.we-online.de/em/datasheet/6130xx11121.pdf; Manufacturer URL: http://www.we-online.de; Row Number: Single; Package Reference: 61300211121; Part Number: 61300211121
P4 = Header 4X2: Header, 4-Pin, Dual row; System: Connector; LatestRevisionDate: 17-Jul-2002; LatestRevisionNote: Re-released for DXP Platform.; Publisher: Altium Limited
Q4 = MOSFET-N: N-Channel MOSFET; Published: 8-Jun-2000; LatestRevisionDate: 17-Jul-2002; LatestRevisionNote: Re-released for DXP Platform.; PackageVersion: 1995/1996; PackageReference: E3; Publisher: Altium Limited; PackageDescription: TO, Flat Index; 3 In-Line, Axial Leads; Body Dia. 4.6mm; Lead Dia. 0.5 mm (max)
R5 R8 R10 R11 = Res1: Resistor; Value: 1K; Published: 8-Jun-2000; LatestRevisionDate: 17-Jul-2002; LatestRevisionNote: Re-released for DXP Platform.; PackageReference: AXIAL-0.3; Publisher: Altium Limited; PackageDescription: Axial Device, Thru-Hole; 2 Leads; 0.3 in Pin Spacing
R6 R7 = Res1: Resistor; Published: 8-Jun-2000; LatestRevisionDate: 17-Jul-2002; LatestRevisionNote: Re-released for DXP Platform.; PackageReference: AXIAL-0.3; Publisher: Altium Limited; PackageDescription: Axial Device, Thru-Hole; 2 Leads; 0.3 in Pin Spacing
  R6: Value: 1K
R17 R18 = Res1: Value: 1K; Published: 8-Jun-2000; LatestRevisionDate: 17-Jul-2002; LatestRevisionNote: Re-released for DXP Platform.; PackageReference: AXIAL-0.3; Publisher: Altium Limited; PackageDescription: Axial Device, Thru-Hole; 2 Leads; 0.3 in Pin Spacing
U2 = 2EDL23I06PJ: Supplier 1: Digi-Key; Supplier Part Number 1: 2EDL23N06PJXUMA1CT-ND
U4 = MAX14931: Supplier 1: Digi-Key

## Nets that join several sheets
+5P: top_tnb_mns_power (7 pins), ch_a (C22_ch_a.1 U1_ch_a.1), ch_a/drvr_bck (C21_ch_a_drvr_bck.1 U4_ch_a_drvr_bck.10 U4_ch_a_drvr_bck.16), ch_a/aleg (C21_ch_a_aleg.1 U4_ch_a_aleg.10 U4_ch_a_aleg.16), ch_a/bleg (C21_ch_a_bleg.1 U4_ch_a_bleg.10 U4_ch_a_bleg.16), ch_b (C22_ch_b.1 U1_ch_b.1), ch_b/drvr_bck (C21_ch_b_drvr_bck.1 U4_ch_b_drvr_bck.10 U4_ch_b_drvr_bck.16), ch_b/aleg (C21_ch_b_aleg.1 U4_ch_b_aleg.10 U4_ch_b_aleg.16), ch_b/bleg (C21_ch_b_bleg.1 U4_ch_b_bleg.10 U4_ch_b_bleg.16), ch_c (C22_ch_c.1 U1_ch_c.1), ch_c/drvr_bck (C21_ch_c_drvr_bck.1 U4_ch_c_drvr_bck.10 U4_ch_c_drvr_bck.16), ch_c/aleg (C21_ch_c_aleg.1 U4_ch_c_aleg.10 U4_ch_c_aleg.16), ch_c/bleg (C21_ch_c_bleg.1 U4_ch_c_bleg.10 U4_ch_c_bleg.16)
PGND: top_tnb_mns_power (29 pins), ch_a (15 pins), ch_a/drvr_bck (12 pins), ch_a/aleg (12 pins), ch_a/bleg (12 pins), ch_b (15 pins), ch_b/drvr_bck (12 pins), ch_b/aleg (12 pins), ch_b/bleg (12 pins), ch_c (15 pins), ch_c/drvr_bck (12 pins), ch_c/aleg (12 pins), ch_c/bleg (12 pins)
VAUX: top_tnb_mns_power (8 pins), ch_a/drvr_bck (P1_ch_a_drvr_bck.2), ch_a/aleg (P1_ch_a_aleg.2), ch_a/bleg (P1_ch_a_bleg.2), ch_b/drvr_bck (P1_ch_b_drvr_bck.2), ch_b/aleg (P1_ch_b_aleg.2), ch_b/bleg (P1_ch_b_bleg.2), ch_c/drvr_bck (P1_ch_c_drvr_bck.2), ch_c/aleg (P1_ch_c_aleg.2), ch_c/bleg (P1_ch_c_bleg.2)
NetC9_ch_a_aleg_1: ch_a/drvr_bck (5 pins), ch_a/aleg (5 pins), ch_a/bleg (5 pins), ch_b/drvr_bck (5 pins), ch_b/aleg (5 pins), ch_b/bleg (5 pins), ch_c/drvr_bck (5 pins), ch_c/aleg (5 pins), ch_c/bleg (5 pins)
VH_BRDG: ch_a/drvr_bck (C15_ch_a_drvr_bck.1 Q3_ch_a_drvr_bck.1), ch_a/aleg (C15_ch_a_aleg.1 Q3_ch_a_aleg.1), ch_a/bleg (C15_ch_a_bleg.1 Q3_ch_a_bleg.1), ch_b/drvr_bck (C15_ch_b_drvr_bck.1 Q3_ch_b_drvr_bck.1), ch_b/aleg (C15_ch_b_aleg.1 Q3_ch_b_aleg.1), ch_b/bleg (C15_ch_b_bleg.1 Q3_ch_b_bleg.1), ch_c/drvr_bck (C15_ch_c_drvr_bck.1 Q3_ch_c_drvr_bck.1), ch_c/aleg (C15_ch_c_aleg.1 Q3_ch_c_aleg.1), ch_c/bleg (C15_ch_c_bleg.1 Q3_ch_c_bleg.1)